# EAGLE design ST4_36 (EAGLE 6.4)
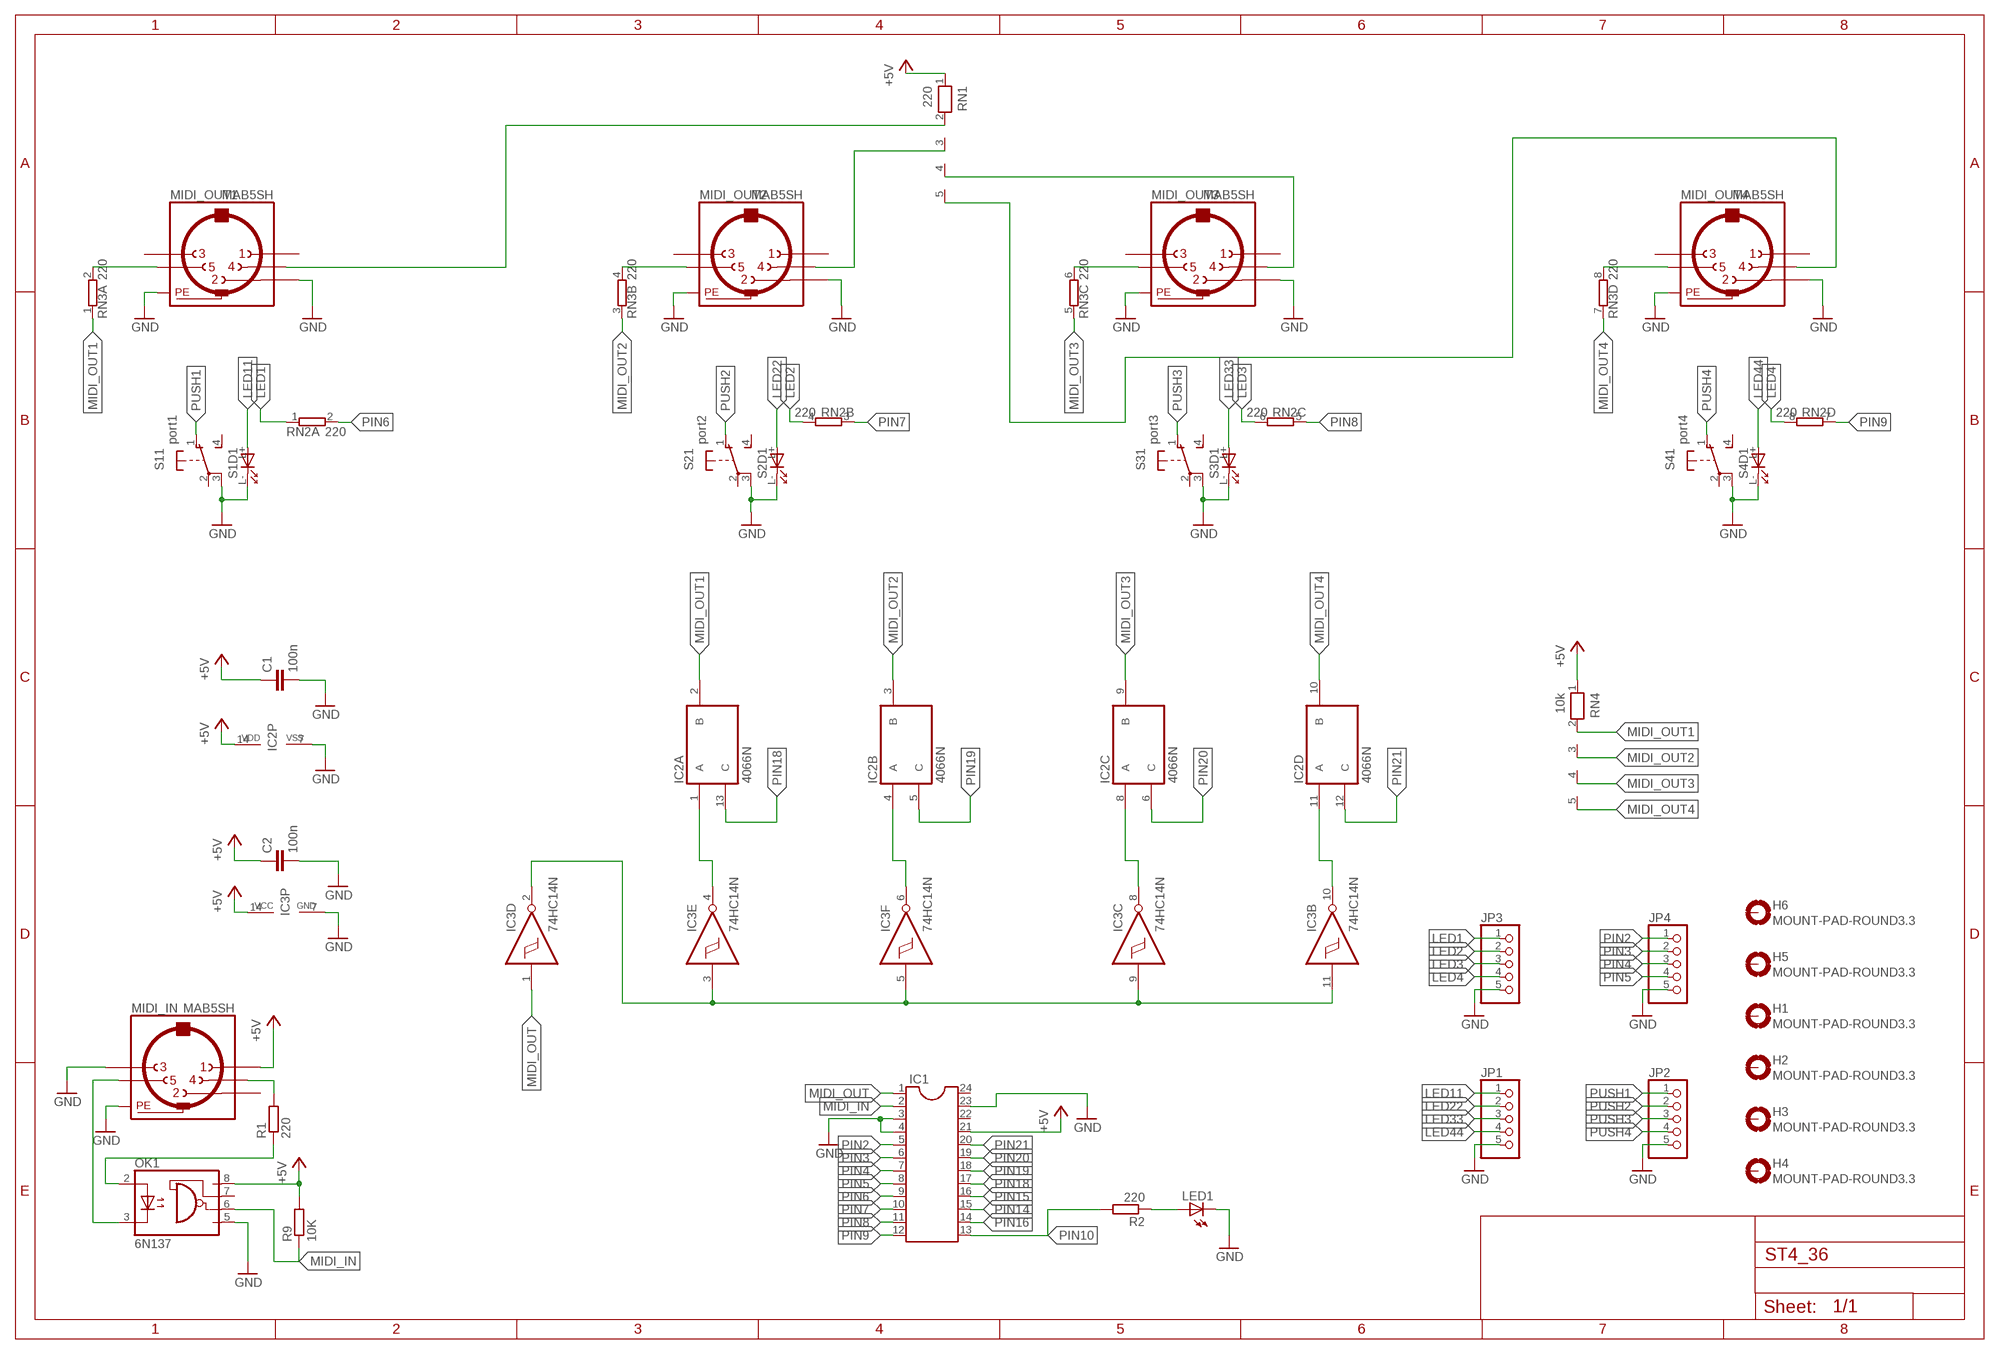
[diagram p0: schematic, sheet 1]

## Parts
C1  100n  C-EU050-024X044  [C050-024X044]
C2  100n  C-EU050-024X044  [C050-024X044]
H1  MOUNT-PAD-ROUND3.3  [3,3-PAD]
H2  MOUNT-PAD-ROUND3.3  [3,3-PAD]
H3  MOUNT-PAD-ROUND3.3  [3,3-PAD]
H4  MOUNT-PAD-ROUND3.3  [3,3-PAD]
H5  MOUNT-PAD-ROUND3.3  [3,3-PAD]
H6  MOUNT-PAD-ROUND3.3  [3,3-PAD]
IC1  DIL24-6  [DIL24-6]
IC2  4066N  [DIL14]
IC3  74HC14N  [DIL14]
JP1  PINHD-1X5  [1X05]
JP2  PINHD-1X5  [1X05]
JP3  PINHD-1X5  [1X05]
JP4  PINHD-1X5  [1X05]
LED1  LED_LED3MM  [LED_LED3MM]
MIDI_IN  MAB5SH  [MAB5SH]
MIDI_OUT1  MAB5SH  [MAB5SH]
MIDI_OUT2  MAB5SH  [MAB5SH]
MIDI_OUT3  MAB5SH  [MAB5SH]
MIDI_OUT4  MAB5SH  [MAB5SH]
OK1  6N137  [DIL08]
R1  220  R-EU_0207/7  [0207/7]
R2  220  R-EU_0207/7  [0207/7]
R9  10K  R-EU_0207/7  [0207/7]
RN1  220  RN04  [RN-5]
RN2  220  E4R  [SIL8]
RN3  220  E4R  [SIL8]
RN4  10k  RN04  [RN-5]
S1  port1  SRKLSHANPU_SPL  [SPLG1YCS0014]
S2  port2  SRKLSHANPU_SPL  [SPLG1YCS0014]
S3  port3  SRKLSHANPU_SPL  [SPLG1YCS0014]
S4  port4  SRKLSHANPU_SPL  [SPLG1YCS0014]

## Nets
+5V [5vdc]: C1.1 C2.1 IC1.21 IC2.14(P:VDD) IC3.14(P:VCC) MIDI_IN.1 OK1.8(VCC) R9.2 RN1.1 RN4.1
GND [gnd]: C1.2 C2.2 IC1.3 IC1.4 IC1.23 IC2.7(P:VSS) IC3.7(P:GND) JP1.5 JP2.5 JP3.5 JP4.5 LED1.K(C) MIDI_IN.3 MIDI_IN.PE MIDI_IN.PE@(PE) MIDI_OUT1.2 MIDI_OUT1.PE MIDI_OUT1.PE@(PE) MIDI_OUT2.2 MIDI_OUT2.PE MIDI_OUT2.PE@(PE) MIDI_OUT3.2 MIDI_OUT3.PE MIDI_OUT3.PE@(PE) MIDI_OUT4.2 MIDI_OUT4.PE MIDI_OUT4.PE@(PE) OK1.5(GND) S1.3(1:P) S1.L-(D1:C) S2.3(1:P) S2.L-(D1:C) S3.3(1:P) S3.L-(D1:C) S4.3(1:P) S4.L-(D1:C)
LED1: JP3.1 RN2.1
LED2: JP3.2 RN2.4
LED3: JP3.3 RN2.6
LED4: JP3.4 RN2.8
LED11: JP1.1 S1.L+(D1:A)
LED22: JP1.2 S2.L+(D1:A)
LED33: JP1.3 S3.L+(D1:A)
LED44: JP1.4 S4.L+(D1:A)
MIDI_IN: IC1.2 OK1.6(VO) R9.1
MIDI_OUT: IC1.1 IC3.1(D:I)
MIDI_OUT1: IC2.2(A:B) RN3.1 RN4.2
MIDI_OUT2: IC2.3(B:B) RN3.3 RN4.3
MIDI_OUT3: IC2.9(C:B) RN3.5 RN4.4
MIDI_OUT4: IC2.10(D:B) RN3.7 RN4.5
N$1: MIDI_OUT2.5 RN3.4
N$2: MIDI_OUT3.5 RN3.6
N$3: MIDI_OUT4.5 RN3.8
N$4: MIDI_OUT4.4 RN1.5
N$5: MIDI_IN.5 OK1.3(C)
N$6: OK1.2(A) R1.1
N$7: MIDI_IN.4 R1.2
N$8: MIDI_OUT1.5 RN3.2
N$9: MIDI_OUT2.4 RN1.3
N$10: MIDI_OUT1.4 RN1.2
N$11: MIDI_OUT3.4 RN1.4
N$12: LED1.A R2.1
N$24: IC3.2(D:O) IC3.3(E:I) IC3.5(F:I) IC3.9(C:I) IC3.11(B:I)
N$25: IC2.1(A:A) IC3.4(E:O)
N$26: IC2.4(B:A) IC3.6(F:O)
N$27: IC2.8(C:A) IC3.8(C:O)
N$28: IC2.11(D:A) IC3.10(B:O)
PIN2: IC1.5 JP4.1
PIN3: IC1.6 JP4.2
PIN4: IC1.7 JP4.3
PIN5: IC1.8 JP4.4
PIN6: IC1.9 RN2.2
PIN7: IC1.10 RN2.3
PIN8: IC1.11 RN2.5
PIN9: IC1.12 RN2.7
PIN10: IC1.13 R2.2
PIN14: IC1.15
PIN15: IC1.16
PIN16: IC1.14
PIN18: IC1.17 IC2.13(A:C)
PIN19: IC1.18 IC2.5(B:C)
PIN20: IC1.19 IC2.6(C:C)
PIN21: IC1.20 IC2.12(D:C)
PUSH1: JP2.1 S1.1(1:O)
PUSH2: JP2.2 S2.1(1:O)
PUSH3: JP2.3 S3.1(1:O)
PUSH4: JP2.4 S4.1(1:O)
Unconnected: H1.B3,3(MOUNT) H2.B3,3(MOUNT) H3.B3,3(MOUNT) H4.B3,3(MOUNT) H5.B3,3(MOUNT) H6.B3,3(MOUNT) IC1.22 IC1.24 IC3.12(A:O) IC3.13(A:I) MIDI_IN.2 MIDI_OUT1.1 MIDI_OUT1.3 MIDI_OUT2.1 MIDI_OUT2.3 MIDI_OUT3.1 MIDI_OUT3.3 MIDI_OUT4.1 MIDI_OUT4.3 OK1.7(VE) S1.2(1:P) S1.4(1:S) S2.2(1:P) S2.4(1:S) S3.2(1:P) S3.4(1:S) S4.2(1:P) S4.4(1:S)

## Library data of the parts
C1 C2 = rcl:C-EU: CAPACITOR, European symbol
H1-H6 = holes:MOUNT-PAD-ROUND: MOUNTING PAD, round
IC1 = ic-package:DIL24: Dual In Line
IC2 = 40xx:4066: Quad bilateral ANALOG SWITCH
IC3 = 74xx-eu:74*14: Hex schmitt trigger INVERTER
JP1-JP4 = pinhead:PINHD-1X5: PIN HEADER
LED1 = usb_pcb_vari:LED_LED: LED OSRAM: - CHIPLED LG R971, LG N971, LY N971, LG Q971, LY Q971, LO R971, LY R971 LH N974, LH R974 LS Q976, LO Q976, LY Q976 LO Q996 - Hyper CHIPLED LW Q18S LB Q993, LB Q99A, LB R99A - SideLED LS A670, LO A670, LY A670, LG A670, LP A670 LB A673, LV A673, LT A673, LW A673 LH A674 LY A675 LS A676, LA A676, LO A676, LY A676, LW A676 LS A679, LY A679, LG A679 - Hyper Micro SIDELED® LS Y876, LA Y876, LO Y876, LY Y876 LT Y87S - SmartLED LW L88C, LW L88S LB L89C, LB L89S, LG L890 LS L89K, LO L89K, LY L89K LS L896, LA L896, LO L896, LY L896 - TOPLED LS T670, LO T670, LY T670, LG T670, LP T670 LSG T670, LSP T670, LSY T670, LOP T670, LYG T670 LG T671, LOG T671, LSG T671 LB T673, LV T673, LT T673, LW T673 LH T674 LS T676, LA T676, LO T676, LY T676, LB T676, LH T676, LSB T676, LW T676 LB T67C, LV T67C, LT T67C, LS T67K, LO T67K, LY T67K, LW E67C LS E67B, LA E67B, LO E67B, LY E67B, LB E67C, LV E67C, LT E67C LW T67C LS T679, LY T679, LG T679 LS T770, LO T770, LY T770, LG T770, LP T770 LB T773, LV T773, LT T773, LW T773 LH T774 LS E675, LA E675, LY E675, LS T675 LS T776, LA T776, LO T776, LY T776, LB T776 LHGB T686 LT T68C, LB T68C - Hyper Mini TOPLED® LB M676 - Mini TOPLED Santana® LG M470 LS M47K, LO M47K, LY M47K Source: http://www.osram.convergy.de/
MIDI_IN MIDI_OUT1-MIDI_OUT4 = con-hirschmann:MAB5SH: Female CONNECTOR 5 pins 90 deg. with shield, horizontal (DIN 41524); OC_FARNELL: 809883; OC_NEWARK: unknown
OK1 = optocoupler:6N137: MOTOROLA OPTO COUPLER; MPN: 6N137; OC_FARNELL: 1328376; OC_NEWARK: 52M1895
R1 R2 R9 = rcl:R-EU_: RESISTOR, European symbol
RN1 RN4 = resistor-net:RN04: RESISTOR NETWORK; OC_FARNELL: unknown; OC_NEWARK: unknown
RN2 RN3 = resistor-sil:E4R: SIL RESISTOR; OC_FARNELL: unknown; OC_NEWARK: unknown
S1-S4 = switch-shanpu:SRKL: SWITCH

## Net classes
0 default: width 0.254 mm, drill 0.127 mm, clearance 0.254 mm
1 5vdc: width 0.508 mm, drill 0.127 mm, clearance 0.406 mm
2 gnd: width 0.508 mm, drill 0.127 mm, clearance 0.508 mm

## Board
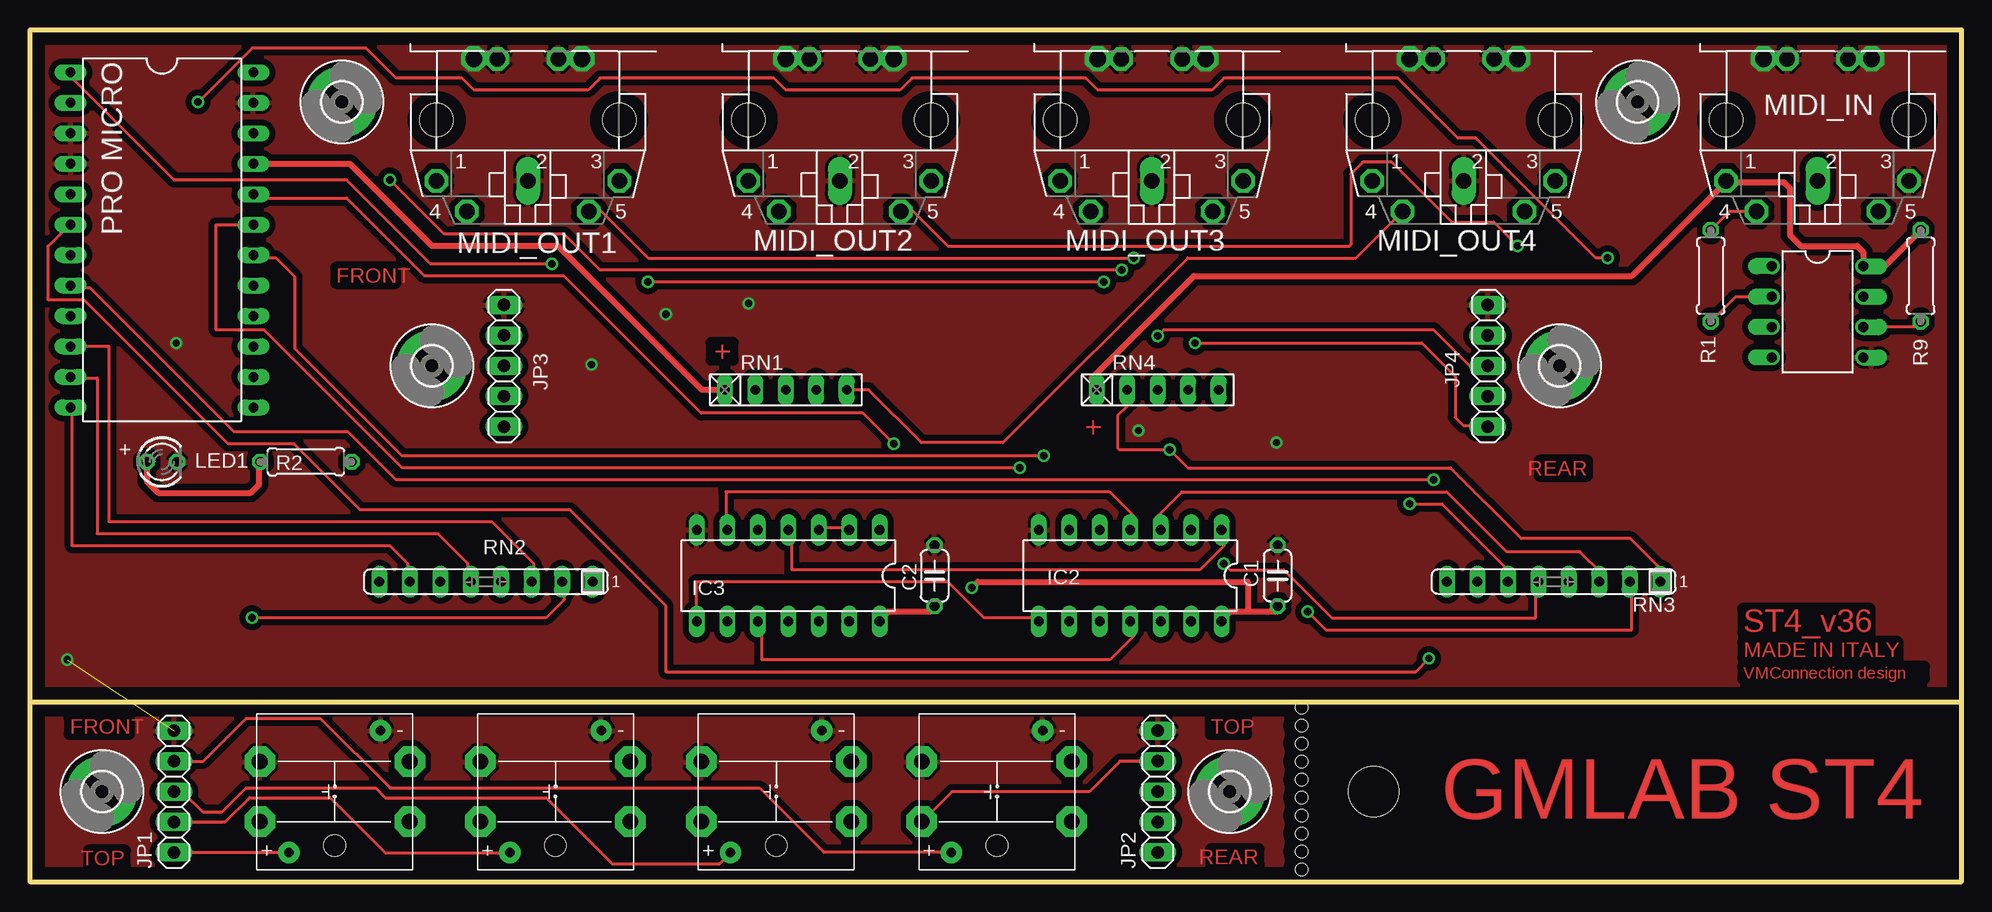
[diagram p1: board, top side]
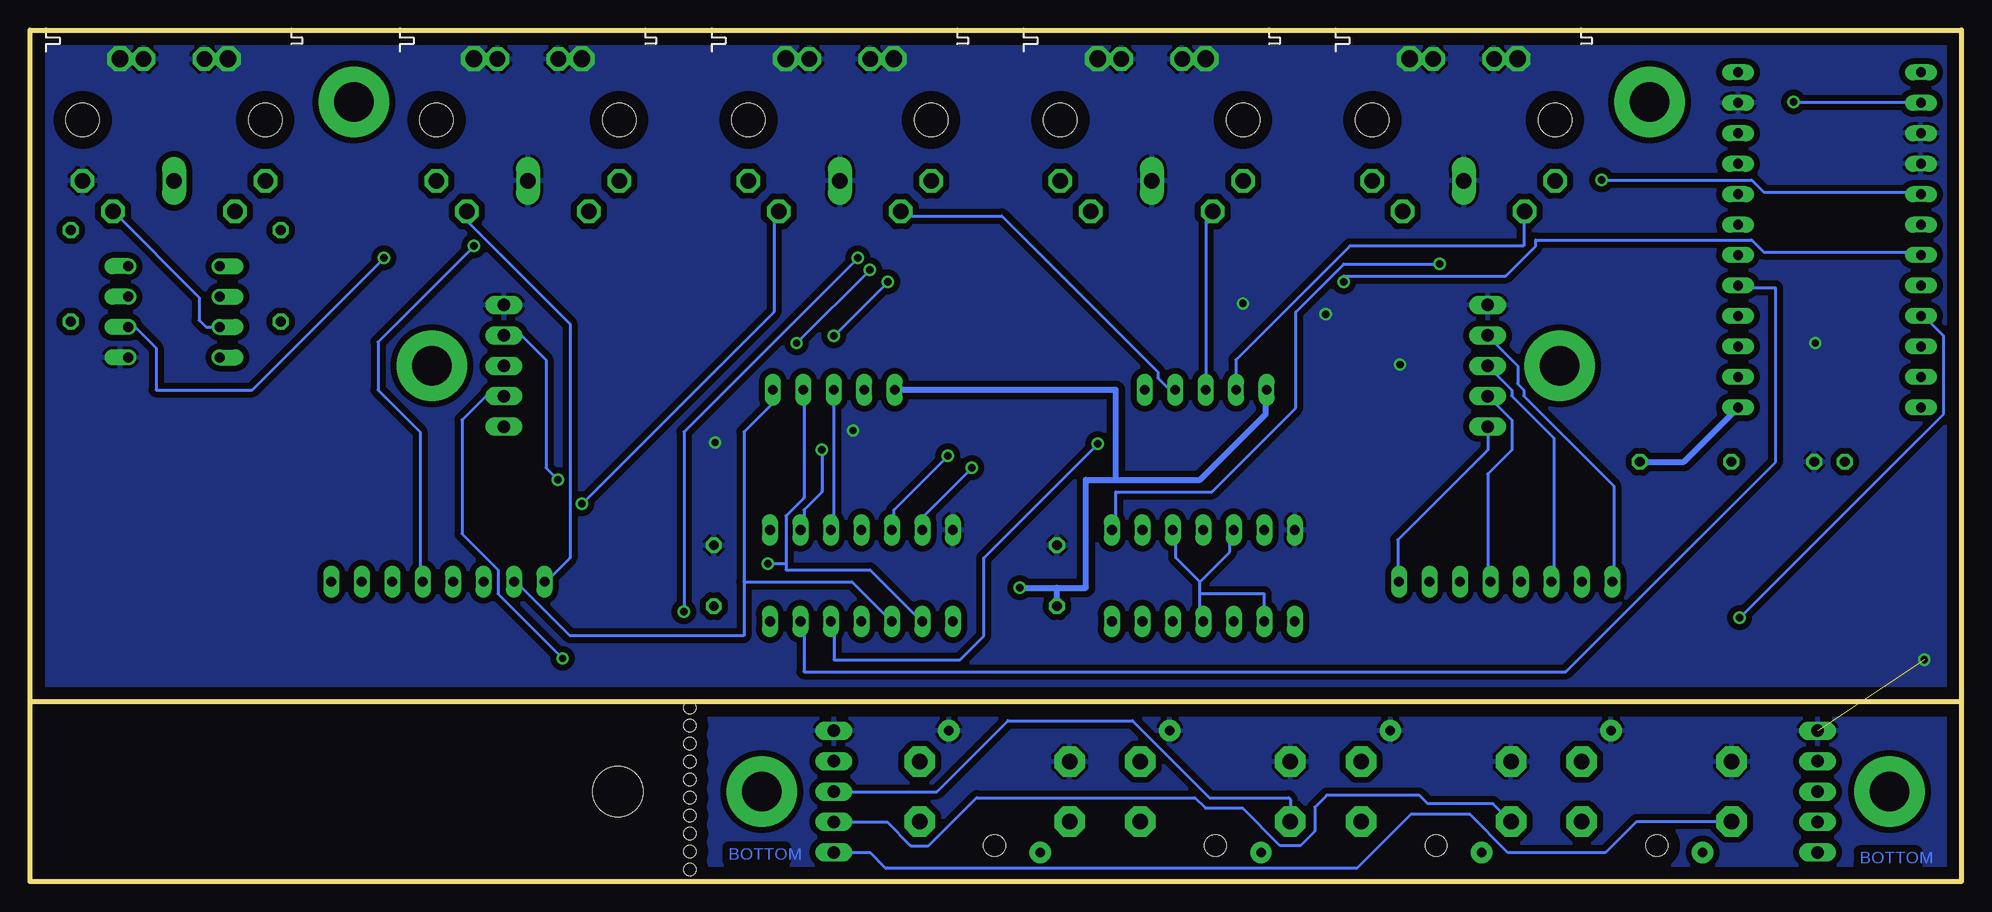
[diagram p2: board, bottom side, seen from below]

Size 161 x 71 mm. Coordinates in mm from the lower left corner, seen from the top.
Outline: 0,15 0,0 161,0 161,15
Outline: 0,15 0,71 161,71 161,15
Outline: 0,15 161,15
Copper layers (1*16): Top 0.035mm / dielectric 1.5mm / Bottom 0.035mm
Design rules "default": minimum track width 10mil, minimum drill 24mil, track to track 8mil, track to pad 8mil, pad to pad 8mil, via to via 8mil, smd to smd 8mil, copper to edge 40mil, drill to drill 8mil, minimum pad ring 10mil, minimum via ring 8mil, stop-mask expansion 4mil, vias tented up to drill 0mil, thermal gap 10mil
Holes 4.2 mm at 112,7.5
Holes 1 mm at 106,1 106,2.5 106,4 106,5.5 106,7 106,10 106,11.5 106,13 106,8.5 106,14.5

### Footprints (pad centres in the part's own frame; a part is rotated, then mirrored left to right if it is on the bottom)
C050-024X044 = drill 0.813 octagon: 1 -2.54,0; 2 2.54,0
3,3-PAD = drill 3.3 pad 5.842: B3,3 0,0
DIL24-6 = drill 0.813 long: 1 -13.97,-7.62; 2 -11.43,-7.62; 3 -8.89,-7.62; 4 -6.35,-7.62; 5 -3.81,-7.62; 6 -1.27,-7.62; 7 1.27,-7.62; 8 3.81,-7.62; 9 6.35,-7.62; 10 8.89,-7.62; 11 11.43,-7.62; 12 13.97,-7.62; 13 13.97,7.62; 14 11.43,7.62; 15 8.89,7.62; 16 6.35,7.62; 17 3.81,7.62; 18 1.27,7.62; 19 -1.27,7.62; 20 -3.81,7.62; 21 -6.35,7.62; 22 -8.89,7.62; 23 -11.43,7.62; 24 -13.97,7.62
DIL14 = drill 0.813 long: 1 -7.62,-3.81; 2 -5.08,-3.81; 3 -2.54,-3.81; 4 0,-3.81; 5 2.54,-3.81; 6 5.08,-3.81; 7 7.62,-3.81; 8 7.62,3.81; 9 5.08,3.81; 10 2.54,3.81; 11 0,3.81; 12 -2.54,3.81; 13 -5.08,3.81; 14 -7.62,3.81
1X05 = drill 1.016 long: 1 -5.08,0; 2 -2.54,0; 3 0,0; 4 2.54,0; 5 5.08,0
LED_LED3MM = drill 0.813 octagon: A -1.27,0; K 1.27,0
MAB5SH = drill 1.321 octagon: 1 7.62,5.08; 3 -7.62,5.08; 4 5.08,7.62; 5 -5.08,7.62; PE -2.54,-5.08; PE@ 2.54,-5.08 | drill 1.321 long: 2 0,5.08 | hole 2.794: 7.62,0; -7.62,0
DIL08 = drill 0.813 offset: 1 -3.81,-3.81; 2 -1.27,-3.81; 3 1.27,-3.81; 4 3.81,-3.81; 5 3.81,3.81; 6 1.27,3.81; 7 -1.27,3.81; 8 -3.81,3.81
0207/7 = drill 0.813 octagon: 1 -3.81,0; 2 3.81,0
RN-5 = drill 0.813 long: 1 -5.08,0; 2 -2.54,0; 3 0,0; 4 2.54,0; 5 5.08,0
SIL8 = drill 0.813 long: 1 -8.89,0; 2 -6.35,0; 3 -3.81,0; 4 -1.27,0; 5 1.27,0; 6 3.81,0; 7 6.35,0; 8 8.89,0
SPLG1YCS0014 = drill 1.3 pad 2.54 octagon: 1 -6.25,-2.5; 2 6.25,-2.5; 3 -6.25,2.5; 4 6.25,2.5 | drill 0.8 pad 1.778: L+ -3.81,-5.08; L- 3.81,5.08 | hole 1.8: 0,-4.5

### Placement (x,y rotation side)
C1  104,25.5 90 top
C2  75.4,25.5 90 top
H1  33.5,43 0 top
H2  127.5,43 0 top
H3  6,7.5 0 top
H4  100,7.5 0 top
H5  26,65 0 top
H6  134,65 0 top
IC1  11,53.5 270 top
IC2  91.7,25.5 180 top
IC3  63.2,25.5 180 top
JP1  12,7.5 90 top
JP2  94,7.5 90 top
JP3  39.5,43 90 top
JP4  121.5,43 90 top
LED1  11,35 0 top
MIDI_IN  149,63.5 180 top
MIDI_OUT1  41.5,63.5 180 top
MIDI_OUT2  67.5,63.5 180 top
MIDI_OUT3  93.5,63.5 180 top
MIDI_OUT4  119.5,63.5 180 top
OK1  149,47.5 270 top
R1  140.1,50.5 90 top
R2  23,35 0 top
R9  157.6,50.5 90 top
RN1  63,41 0 top
RN2  38,25 180 top
RN3  127,25 180 top
RN4  94,41 0 top
S1  25.4,7.5 0 top
S2  43.8,7.5 0 top
S3  62.2,7.5 0 top
S4  80.6,7.5 0 top

### Tracks (layer width: path | path; a pad name or v marks a point on that pad's centre or on a via)
+5V  (via drill 0.61)
  Top 0.508: R9.2 154.6,51.31 OK1.8 152.81,52.49 152.3,53 147.6,53 146.7,53.9 146.7,57.8 146.2,58.3 141.5,58.3 MIDI_IN.1 141,58 133.5,50.5 97,50.5 88.5,42 88.5,41 RN4.1 | 101.5,22.5 104,22.5 C1.1 | 101.5,22.5 100,22.5 99.5,22 IC2.14 | IC3.14 71,22 71.5,22.5 75,22.5 C2.1 | RN1.1 56,41 44,53 33.5,53 26.65,59.85 IC1.21 19,60 | 101.5,22.5 101.5,25 79,25 v78.5,24.5
  Bottom 0.508: 70.5,33.5 73,33.5 73,24.5 75.4,24.5 | 70.5,33.5 63.5,33.5 58,39 58,41 RN1.1 | RN4.1 70.5,41 70.5,33.5 | 75.5,23 C2.1 75,23 75.4,23 75.4,24.5 | v78.5,24.5 75.4,24.5
GND  (via drill 0.6, 1.4)  (1 unrouted)
  other vias: 46.8,43.1 37,68.6 46,68.6 63,68.6 72,68.6 89,68.6 98,68.6 115,68.6 124,68.6 144.5,68.6 153.5,68.6 12.2,44.9 53,47.3 59.9,48.2 92.4,37.6 103.9,36.6 3.1,18.5
  pour Top (isolate 0.406): 0,15 161,15 161,71 0,71
  pour Bottom (isolate 0.406): 0,15 161,15 161,71 0,71
  pour Top (isolate 0.406): 0,0 106,0 106,15 0,15
  pour Bottom (isolate 0.406): 0,0 106,0 106,15 0,15
LED1
  Bottom 0.254: 39.5,38 JP3.1 39.5,36 47,28.5 47,25 RN2.1
LED2
  Bottom 0.254: RN2.4 39.5,25 39.5,34 37.5,36 37.5,38.5 39.5,40.5 JP3.2
LED3
  Bottom 0.254: JP3.3 37.5,41 37.5,40.5 34,37 34,25 RN2.6
LED4
  Bottom 0.254: RN2.8 29,25 29,33 36.5,40.5 36.5,41 37,41.5 37,43 39.5,45.5 JP3.4
LED11
  Top 0.254: JP1.1 S1.L+
LED22
  Top 0.254: JP1.2 16.26,4.96 18.3,7 25,7 29.6,2.4 39.97,2.4 S2.L+
LED33
  Top 0.254: JP1.3 12.7,7.5 14.4,5.8 16,5.8 18,7.8 28.8,7.8 29.6,7 43,7 48.5,1.5 57.47,1.5 S3.L+
LED44
  Top 0.254: JP1.4 14.44,10.04 18,13.6 24.2,13.6 30,7.8 60.8,7.8 66.18,2.42 S4.L+
MIDI_IN  (via drill 0.61)
  Top 0.254: R9.1 157.14,46.23 OK1.6 | v14,65 18.5,69.5 28,69.5 30.5,67 36,67 37,66 46.5,66 47.5,67 62,67 63,66 72.5,66 73.5,67 88,67 89,66 98.5,66 99.5,67 114,67 119,62 120.5,62 130.5,52 v131.5,52
  Bottom 0.254: v14,65 3.5,65 IC1.2 | v131.5,52 142.5,41 150.5,41 150.5,44.5 152.5,46.5 OK1.6
MIDI_OUT  (via drill 0.61)
  Top 0.254: v43.5,51.5 33.4,51.5 26.4,58.5 12,58.5 3.5,67 IC1.1
  Bottom 0.254: v43.5,51.5 51.5,51.5 55.5,47.5 55.5,39.5 62.5,32.5 70.5,32.5 70.5,29.5 IC3.1
MIDI_OUT1  (via drill 0.61)
  Top 0.254: 91.5,41 RN4.2 91.46,39.66 90.7,38.9 90.7,36.1 90.8,36 v95,36 96.5,34.5 118.4,34.5 124.3,28.6 133.4,28.6 136,26 136,25 RN3.1
  Bottom 0.254: v95,36 95,32.5 96.5,31 96.5,29.5 IC2.2
MIDI_OUT2
  Top 0.254: RN3.3 131,25 131,25.7 129.2,27.5 123.1,27.5 118.1,32.5 96,32.5 94,30.5 94,29.5 IC2.3
  Bottom 0.254: RN4.3 94,29.5 IC2.3
MIDI_OUT3  (via drill 0.61)
  Top 0.254: v99.5,26.5 100,26 104.5,26 108.5,22 125.5,22 125.5,25 RN3.5
  Bottom 0.254: 98,26.5 98,30.5 96.5,32 96.5,41 RN4.4 | 98,26.5 98,26 91,26 87,22 IC2.9 | 98,26.5 v99.5,26.5
MIDI_OUT4
  Bottom 0.254: 101.5,25 92.5,25 89.5,22 IC2.10 | 101.5,25 101.5,37.5 99,40 99,41 RN4.5 | 101.5,25 101.5,20.5 116,20.5 120.5,25 RN3.7
N$1  (via drill 0.61)
  Top 0.254: v124,53 122,55 118.5,55 113.5,60 111.1,60 110.1,59 110.1,53.1 110,53 76.5,53 73.5,56 73,56 MIDI_OUT2.5
  Bottom 0.254: v124,53 132,45 132,41 128.5,37.5 128.5,25 RN3.4
N$2  (via drill 0.61)
  Top 0.254: 123,25 RN3.6 123.2,26 117.7,31.5 v115,31.5
  Bottom 0.254: v115,31.5 99,47.5 99,55.5 MIDI_OUT3.5
N$3
  Bottom 0.254: RN3.8 118,25 116,27 116,46.5 124.5,55 124.5,55.5 MIDI_OUT4.5
N$4
  Top 0.254: RN1.5 69.9,41 74.3,36.6 81.1,36.6 96.5,52 110.54,52 MIDI_OUT4.4
N$5
  Bottom 0.254: MIDI_IN.5 146.9,48.7 146.9,46.8 146.33,46.23 OK1.3
N$6
  Top 0.254: R1.1 142.18,48.77 OK1.2
N$7
  Top 0.254: R1.2 141.67,55.88 MIDI_IN.4
N$8  (via drill 0.61)
  Top 0.254: v106.5,22.5 108,21 133.5,21 133.5,25 RN3.2 | v92,52 51.5,52 47.5,56 47,56 MIDI_OUT1.5
  Bottom 0.254: v106.5,22.5 106.5,37.5 v92,52
N$9
  Bottom 0.254: RN1.3 63,55.5 62.5,56 MIDI_OUT2.4
N$10
  Bottom 0.254: RN1.2 60.5,41 60.5,43.5 51,53 36.5,53 36.5,55.5 MIDI_OUT1.4
N$11
  Bottom 0.254: RN1.4 66,41 67,42 67,42.5 80,55.5 88,55.5 MIDI_OUT3.4
N$12
  Top 0.508: LED1.A 9.73,33.37 10.7,32.4 18.4,32.4 19.1,33.1 19.1,34.91 R2.1
N$24
  Top 0.254: IC3.3 66,29.5 68,29.5 IC3.2
  Bottom 0.254: 63.5,25 61,27.5 61,29 IC3.5 | 63.5,24 63.5,22 IC3.11 | 63.5,24 63.5,25 | 63.5,25 65.5,27 65.5,29 IC3.3 | IC3.9 58.12,24 63.5,24
N$25
  Top 0.254: IC3.4 63.5,29 63.5,26 97.5,26 99.5,28 99.5,29 IC2.1
N$26
  Top 0.254: IC3.6 58,29.5 58,32.5 90,32.5 92,30.5 92,29.5 IC2.4
N$27
  Top 0.254: IC3.8 55.5,22 55.5,25 76.5,25 79.5,22 84,22 IC2.8
N$28
  Top 0.254: IC3.10 61,21.5 61,18.5 90,18.5 92,20.5 92,21.5 IC2.11
PIN2  (via drill 0.61)
  Top 0.254: v30,58.5 34.5,54 44.5,54 47.5,51 v91,51 | JP4.1 121.5,38 119.5,38 118.8,38.7 118.8,42.1 116,44.9 v97.1,44.9
  Bottom 0.254: v30,58.5 17.5,58.5 16.5,57.5 3.5,57.5 IC1.5 | v91,51 v97.1,44.9
PIN3  (via drill 0.61)
  Top 0.254: IC1.6 3,54.5 1.5,53 1.5,48.5 4.5,48.5 16.5,36.5 22,36.5 27.5,31 45,31 53,23 53,17.5 115.5,17.5 v116.6,18.6
  Bottom 0.254: JP4.2 121.5,40.5 123,40.5 125,38.5 125,29 122,26 122,24 v116.6,18.6
PIN4  (via drill 0.61)
  Top 0.254: v89.5,50 v51.5,50 | v94,45.5 94.5,46 117,46 120,43 JP4.3
  Bottom 0.254: v51.5,50 51.5,50.5 38,50.5 35.5,53 35.5,53.5 17.5,53.5 16.5,52.5 3.5,52.5 IC1.7 | v94,45.5 v89.5,50
PIN5  (via drill 0.61)
  Top 0.254: v117,33.5 30.5,33.5 26.5,37.5 17,37.5 5,49.5 3.5,49.5 IC1.8
  Bottom 0.254: v117,33.5 118,34.5 118,43.5 120,45.5 121.5,45.5 JP4.4
PIN6  (via drill 0.61)
  Top 0.254: v18.5,22 43,22 44.5,23.5 44.5,25 RN2.2
  Bottom 0.254: v18.5,22 1.5,39 1.5,45.5 3,47 IC1.9
PIN7
  Top 0.254: 3.5,44.5 IC1.10 6.6,44.61 6.6,30 38.5,30 42,26.5 42,25 RN2.3
PIN8
  Top 0.254: IC1.11 3.5,42 5.6,42 5.6,29 34,29 36.5,26.5 36.5,25 RN2.5
PIN9
  Top 0.254: IC1.12 3.5,39.5 3.5,28 30,28 31.5,26.5 31.5,25 RN2.7
PIN10
  Bottom 0.508: R2.2 23.15,35 IC1.13
PIN18
  Bottom 0.254: IC1.17 18.5,49.5 15.5,49.5 15.5,35 33,17.5 96.5,17.5 96.5,21.5 IC2.13
PIN19  (via drill 0.61)
  Top 0.254: v84.5,35.5 31,35.5 22.1,44.4 22.1,50.4 20.5,52 19,52 IC1.18
  Bottom 0.254: v84.5,35.5 89,31 89,29.5 IC2.5
PIN20  (via drill 0.61)
  Top 0.254: v82.5,34.5 31,34.5 19.5,46 15.5,46 15.5,54.77 IC1.19
  Bottom 0.254: v82.5,34.5 86.5,30.5 86.5,29.5 IC2.6
PIN21  (via drill 0.61)
  Top 0.254: IC1.20 19,57 26.4,57 32.9,50.5 44.5,50.5 55.95,39.05 69.45,39.05 v72,36.5
  Bottom 0.254: v72,36.5 81.5,27 81.5,20.5 83.5,18.5 94,18.5 94,21.5 IC2.12
PUSH1
  Bottom 0.254: S1.1 27.1,5 29.7,2.4 37.8,2.4 41,5.6 45.9,5.6 50.4,1.1 89.68,1.1 91,2.42 JP2.1
PUSH2
  Bottom 0.254: JP2.2 89.56,4.96 87.6,3 86.1,3 82.1,7 63.9,7 63,6.1 59.9,6.1 56.8,3 55.1,3 53.9,4.2 53.9,6.2 52.9,7.2 45.2,7.2 44.5,6.5 39.05,6.5 S2.1
PUSH3
  Bottom 0.254: JP2.3 85.4,7.5 79.5,13.4 69.1,13.4 62.7,7 56.1,7 55.95,6.85 S3.1
PUSH4
  Top 0.254: JP2.4 90.84,10.04 88.3,7.5 76.85,7.5 S4.1

### Text on the board
Top: FRONT | + | + | REAR | ST4_v36 | MADE IN ITALY | VMConnection design | FRONT | TOP | GMLAB ST4 | TOP | REAR
Bottom: BOTTOM | BOTTOM
tNames: PRO MICRO | +